# EAGLE design final 1 (EAGLE 8.1.0)
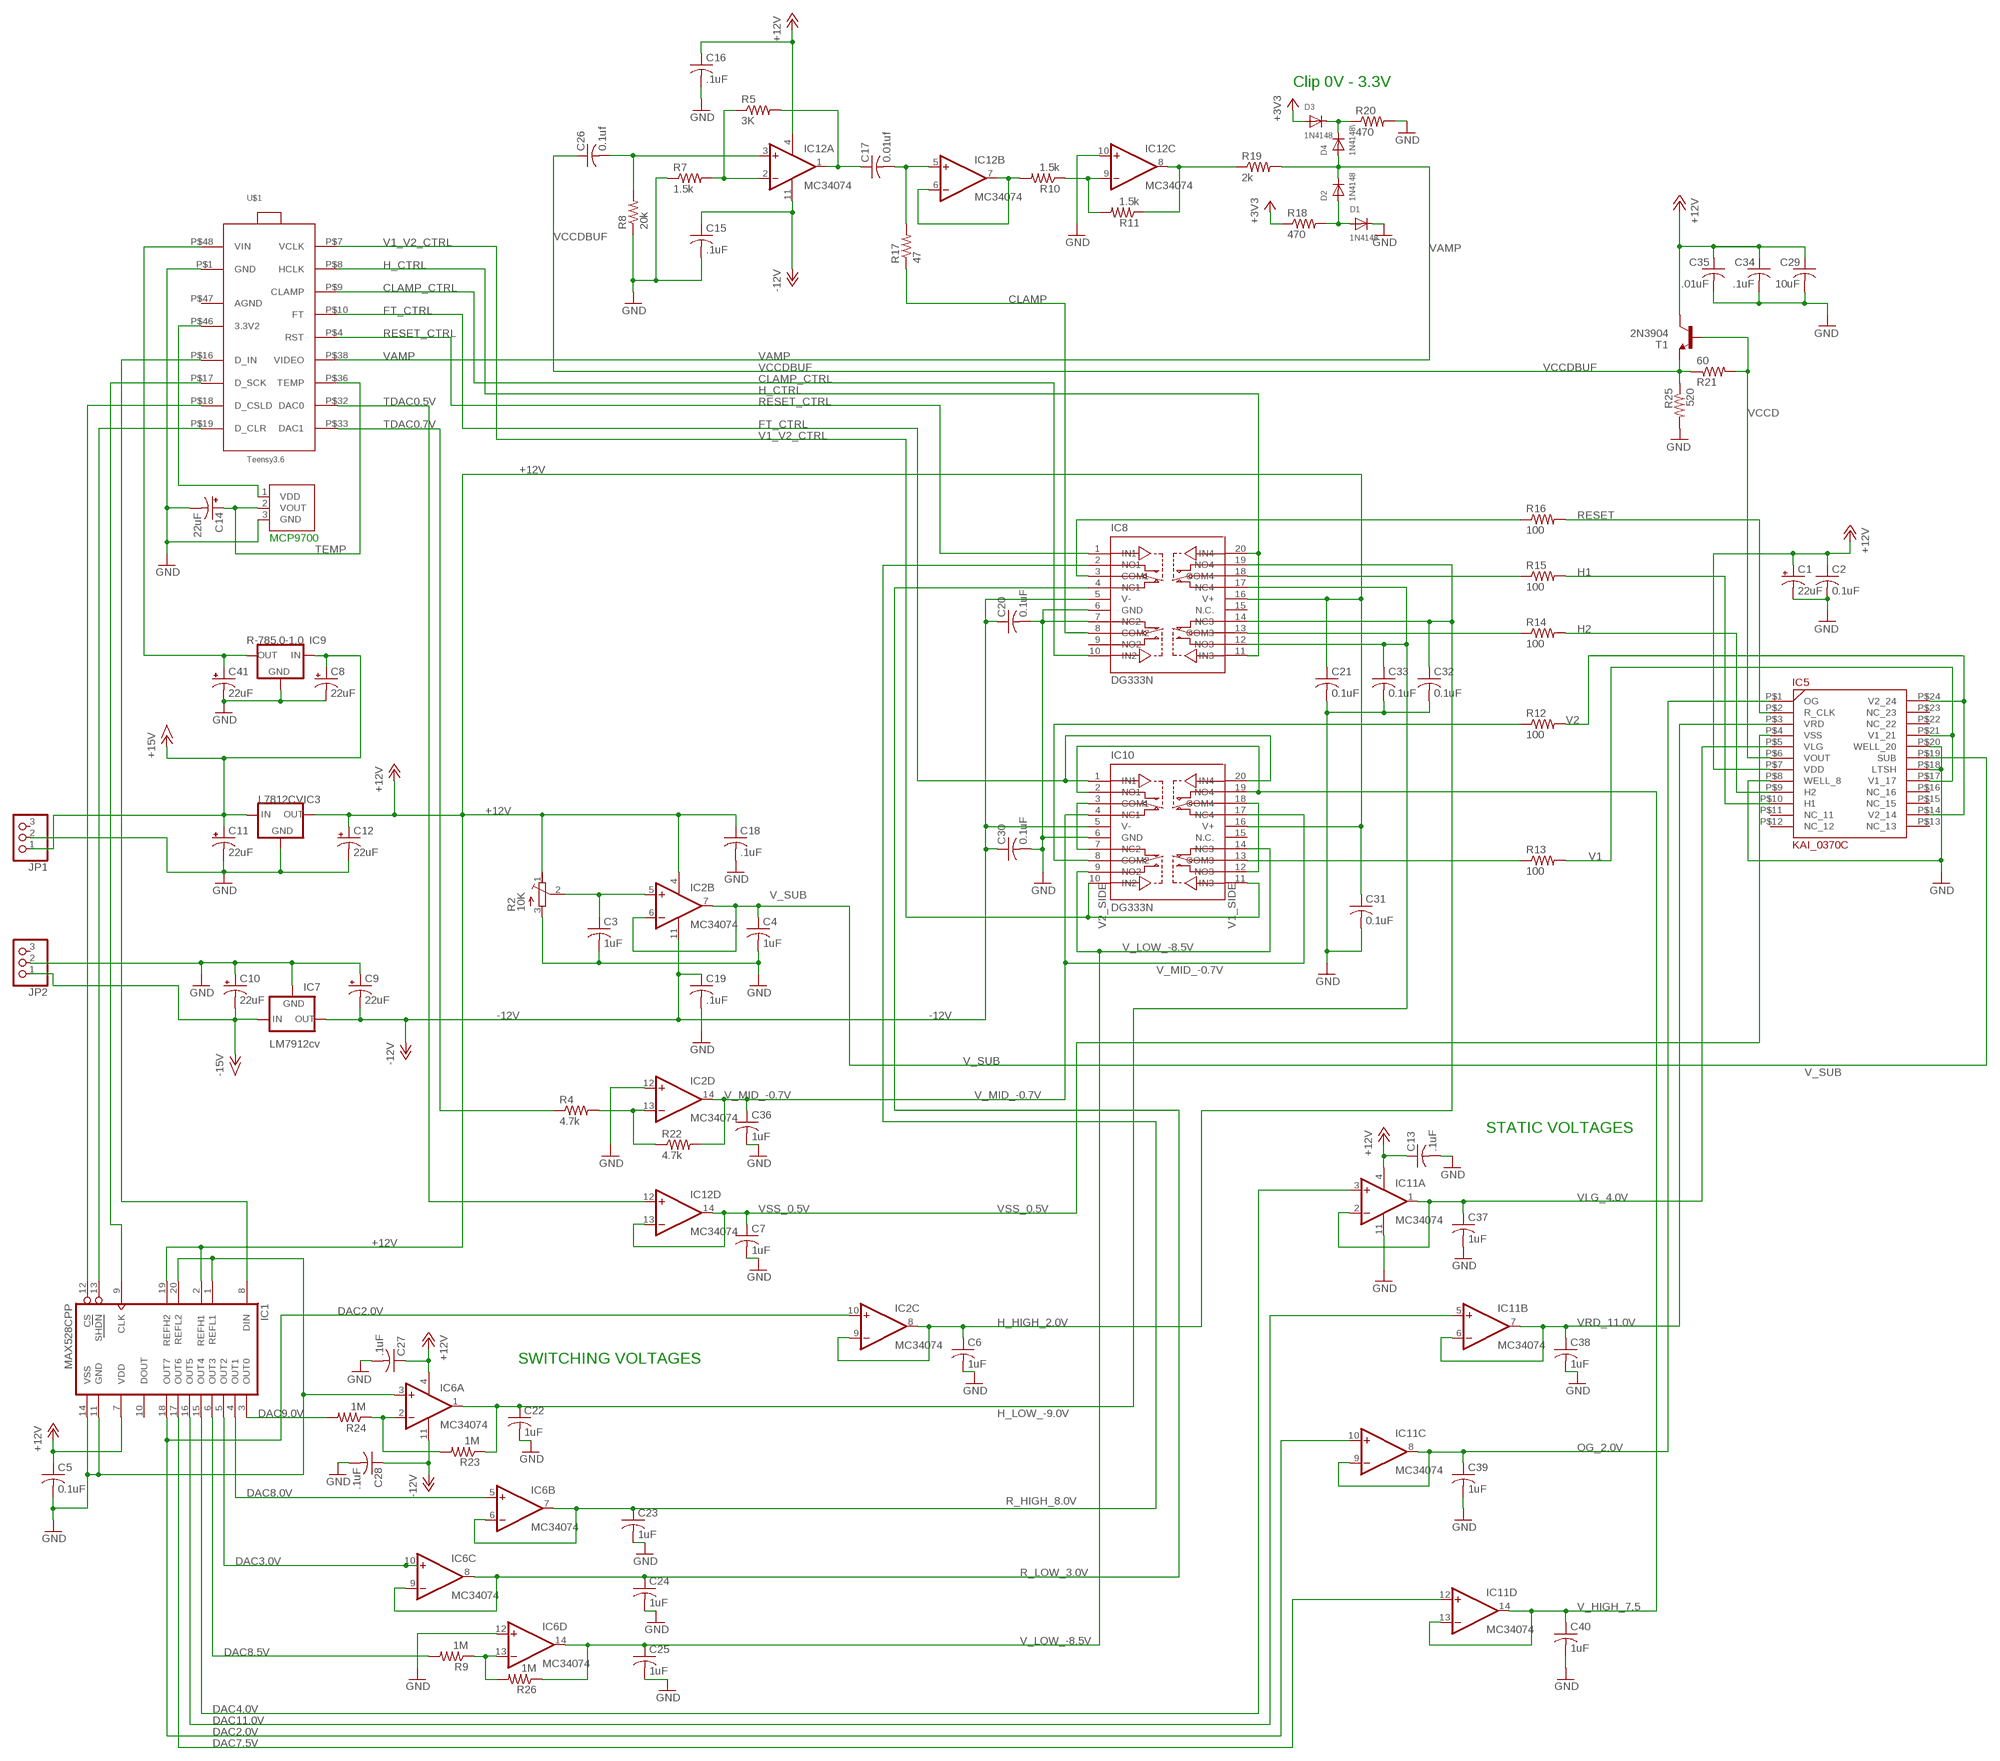
[diagram p0: schematic, sheet 1]

## Parts
C1  22uF  CPOL-USSANYO_F  [SANYO-OSCON_F]
C2  0.1uF  C-US050-050X075  [C050-050X075]
C3  1uF  C-US050-050X075  [C050-050X075]
C4  1uF  C-US050-050X075  [C050-050X075]
C5  0.1uF  C-US050-050X075  [C050-050X075]
C6  1uF  C-US050-050X075  [C050-050X075]
C7  1uF  C-US050-050X075  [C050-050X075]
C8  22uF  CPOL-USSANYO_F  [SANYO-OSCON_F]
C9  22uF  CPOL-USSANYO_F  [SANYO-OSCON_F]
C10  22uF  CPOL-USSANYO_F  [SANYO-OSCON_F]
C11  22uF  CPOL-USSANYO_F  [SANYO-OSCON_F]
C12  22uF  CPOL-USSANYO_F  [SANYO-OSCON_F]
C13  .1uF  C-US050-050X075  [C050-050X075]
C14  22uF  CPOL-USSANYO_F  [SANYO-OSCON_F]
C15  .1uF  C-US050-050X075  [C050-050X075]
C16  .1uF  C-US050-050X075  [C050-050X075]
C17  0.01uf  C-US050-050X075  [C050-050X075]
C18  .1uF  C-US050-050X075  [C050-050X075]
C19  .1uF  C-US050-050X075  [C050-050X075]
C20  0.1uF  C-US050-050X075  [C050-050X075]
C21  0.1uF  C-US050-050X075  [C050-050X075]
C22  1uF  C-US050-050X075  [C050-050X075]
C23  1uF  C-US050-050X075  [C050-050X075]
C24  1uF  C-US050-050X075  [C050-050X075]
C25  1uF  C-US050-050X075  [C050-050X075]
C26  0.1uf  C-US050-050X075  [C050-050X075]
C27  .1uF  C-US050-050X075  [C050-050X075]
C28  .1uF  C-US050-050X075  [C050-050X075]
C29  10uF  C-US050-050X075  [C050-050X075]
C30  0.1uF  C-US050-050X075  [C050-050X075]
C31  0.1uF  C-US050-050X075  [C050-050X075]
C32  0.1uF  C-US050-050X075  [C050-050X075]
C33  0.1uF  C-US050-050X075  [C050-050X075]
C34  .1uF  C-US050-050X075  [C050-050X075]
C35  .01uF  C-US050-050X075  [C050-050X075]
C36  1uF  C-US050-050X075  [C050-050X075]
C37  1uF  C-US050-050X075  [C050-050X075]
C38  1uF  C-US050-050X075  [C050-050X075]
C39  1uF  C-US050-050X075  [C050-050X075]
C40  1uF  C-US050-050X075  [C050-050X075]
C41  22uF  CPOL-USSANYO_F  [SANYO-OSCON_F]
D1  1N4148  DIODEDO-1N4148  [DO-1N4148]
D2  1N4148  DIODEDO-1N4148  [DO-1N4148]
D3  1N4148  DIODEDO-1N4148  [DO-1N4148]
D4  1N4148\  DIODEDO-1N4148  [DO-1N4148]
IC1  MAX528CPP  [DIL20]
IC2  MC34074  LM324N  [DIL14]
IC3  L7812CV  78XXS  [78XXS]
IC5  KAI_0370C  [KAI-0370C]
IC6  MC34074  LM324N  [DIL14]
IC7  LM7912cv  79XXS  [79XXS]
IC8  DG333N  MAX333N  [DIL20]
IC9  R-785.0-1.0  [SIP3]
IC10  DG333N  MAX333N  [DIL20]
IC11  MC34074  LM324N  [DIL14]
IC12  MC34074  LM324N  [DIL14]
JP1  PINHD-1X3  [1X03]
JP2  PINHD-1X3  [1X03]
R2  10K  R-TRIMM3006P  [RTRIM3006P]
R4  4.7k  R-US_0207/2V  [0207/2V]
R5  3K  R-US_0207/2V  [0207/2V]
R7  1.5k  R-US_0207/2V  [0207/2V]
R8  20k  R-US_0207/2V  [0207/2V]
R9  1M  R-US_0207/2V  [0207/2V]
R10  1.5k  R-US_0207/2V  [0207/2V]
R11  1.5k  R-US_0207/2V  [0207/2V]
R12  100  R-US_0207/2V  [0207/2V]
R13  100  R-US_0207/2V  [0207/2V]
R14  100  R-US_0207/2V  [0207/2V]
R15  100  R-US_0207/2V  [0207/2V]
R16  100  R-US_0207/2V  [0207/2V]
R17  47  R-US_0207/2V  [0207/2V]
R18  470  R-US_0207/2V  [0207/2V]
R19  2k  R-US_0207/2V  [0207/2V]
R20  470  R-US_0207/2V  [0207/2V]
R21  60  R-US_0207/2V  [0207/2V]
R22  4.7k  R-US_0207/2V  [0207/2V]
R23  1M  R-US_0207/2V  [0207/2V]
R24  1M  R-US_0207/2V  [0207/2V]
R25  520  R-US_0207/2V  [0207/2V]
R26  1M  R-US_0207/2V  [0207/2V]
T1  2N3904  [TO92]
U$1  TEENSY3.6LIMITED  [DIL]
U$2  MCP970XTO  [TO92]

## Nets
+3V3: D3.A R18.1
+5V: C41.+ IC9.3(OUT) U$1.P$48(VIN)
+12V: C1.+ C2.1 C5.1 C12.+ C13.1 C16.1 C18.1 C21.1 C27.1 C29.1 C31.1 C34.1 C35.1 IC1.2(REFH1) IC1.7(VDD) IC1.19(REFH2) IC2.4(P:V+) IC3.OUT IC5.P$7(VDD) IC6.4(P:V+) IC8.16(V+) IC10.16(V+) IC11.4(P:V+) IC12.4(P:V+) R2.1(A) T1.1(C)
+15V: C8.+ C11.+ IC3.IN IC9.1(IN) JP1.1
-12V: C9.- C15.1 C19.1 C20.1 C28.1 C30.1 IC2.11(P:V-) IC6.11(P:V-) IC7.OUT IC8.5(V-) IC10.5(V-) IC12.11(P:V-)
-15V: C10.- IC7.IN JP2.1
CLAMP: IC8.8(COM2) R17.1
CLAMP_CTRL: IC8.10(IN2) U$1.P$9(CLAMP)
DAC2.0V: IC1.18(OUT7) IC2.10(C:+IN) IC11.10(C:+IN)
DAC3.0V: IC1.5(OUT2) IC6.10(C:+IN)
DAC4.0V: IC1.15(OUT4) IC11.3(A:+IN)
DAC7.5V: IC1.17(OUT6) IC11.12(D:+IN)
DAC8.0V: IC1.4(OUT1) IC6.5(B:+IN)
DAC8.5V: IC1.6(OUT3) R9.2
DAC9.0V: IC1.3(OUT0) R24.2
DAC11.0V: IC1.16(OUT5) IC11.5(B:+IN)
FT_CTRL: IC10.1(IN1) IC10.20(IN4) U$1.P$10(FT)
GND: C1.- C2.2 C3.2 C4.2 C5.2 C6.2 C7.2 C8.- C9.+ C10.+ C11.- C12.- C13.2 C14.- C15.2 C16.2 C18.2 C19.2 C20.2 C21.2 C22.2 C23.2 C24.2 C25.2 C27.2 C28.2 C29.2 C30.2 C31.2 C32.2 C33.2 C34.2 C35.2 C36.2 C37.2 C38.2 C39.2 C40.2 C41.- D1.C IC1.1(REFL1) IC1.11(GND) IC1.14(VSS) IC1.20(REFL2) IC2.12(D:+IN) IC3.GND IC5.P$8(WELL_8) IC5.P$18(LTSH) IC5.P$20(WELL_20) IC6.3(A:+IN) IC6.12(D:+IN) IC7.GND IC8.6(GND) IC8.7(NC2) IC9.2(GND) IC10.6(GND) IC11.11(P:V-) IC12.10(C:+IN) JP1.2 JP2.2 R2.3(E) R7.1 R8.1 R20.2 R25.2 U$1.P$1(GND) U$2.3(GND)
H1: IC5.P$10(H1) R15.2
H2: IC5.P$9(H2) R14.2
H_CTRL: IC8.11(IN3) IC8.20(IN4) U$1.P$8(HCLK)
H_HIGH_2.0V: C6.1 C32.1 IC2.8(C:OUT) IC2.9(C:-IN) IC8.14(NC3) IC8.19(NO4)
H_LOW_-9.0V: C22.1 C33.1 IC6.1(A:OUT) IC8.12(NO3) IC8.17(NC4) R23.1
N$3: U$1.P$46(3.3V2) U$2.1(VDD)
N$4: IC10.3(COM1) IC10.7(NC2)
N$5: IC10.8(COM2) R12.1
N$6: IC1.8(DIN) U$1.P$16(D_IN)
N$7: C3.1 IC2.5(B:+IN) R2.2(S)
N$8: C17.1 IC12.1(A:OUT) R5.2
N$9: IC10.12(NO3) IC10.18(COM4)
N$10: IC1.9(CLK) U$1.P$17(D_SCK)
N$11: IC2.13(D:-IN) R4.2 R22.1
N$14: IC12.2(A:-IN) R5.1 R7.2
N$15: IC1.12(CS) U$1.P$18(D_CSLD)
N$16: IC1.13(SHDN) U$1.P$19(D_CLR)
N$18: IC12.8(C:OUT) R11.1 R19.1
N$19: IC8.13(COM3) R14.1
N$20: IC6.2(A:-IN) R23.2 R24.1
N$22: IC8.18(COM4) R15.1
N$25: IC12.6(B:-IN) IC12.7(B:OUT) R10.2
N$28: IC5.P$2(R_CLK) R16.2
N$29: IC12.9(C:-IN) R10.1 R11.2
N$31: C26.2 IC12.3(A:+IN) R8.2
N$33: D1.A D2.A R18.2
N$34: D3.C D4.C R20.1
N$35: C17.2 IC12.5(B:+IN) R17.2
N$36: IC6.13(D:-IN) R9.1 R26.2
OG_2.0V: C39.1 IC5.P$1(OG) IC11.8(C:OUT) IC11.9(C:-IN)
R_HIGH_8.0V: C23.1 IC6.6(B:-IN) IC6.7(B:OUT) IC8.2(NO1)
R_LOW_3.0V: C24.1 IC6.8(C:OUT) IC6.9(C:-IN) IC8.4(NC1)
RESET: IC8.3(COM1) R16.1
RESET_CTRL: IC8.1(IN1) U$1.P$4(RST)
TDAC0.5V: IC12.12(D:+IN) U$1.P$32(DAC0)
TDAC0.7V: R4.1 U$1.P$33(DAC1)
TEMP: C14.+ U$1.P$36(TEMP) U$2.2(VOUT)
V1: IC5.P$17(V1_17) IC5.P$21(V1_21) R13.2
V1_V2_CTRL: IC10.10(IN2) IC10.11(IN3) U$1.P$7(VCLK)
V2: IC5.P$14(V2_14) IC5.P$24(V2_24) R12.2
V_2: IC10.13(COM3) R13.1
V_HIGH_7.5: C40.1 IC10.2(NO1) IC10.19(NO4) IC11.13(D:-IN) IC11.14(D:OUT)
V_LOW_-8.5V: C25.1 IC6.14(D:OUT) IC10.9(NO2) IC10.14(NC3) R26.1
V_MID_-0.7V: C36.1 IC2.14(D:OUT) IC10.4(NC1) IC10.17(NC4) R22.2
V_SUB: C4.1 IC2.6(B:-IN) IC2.7(B:OUT) IC5.P$19(SUB)
VAMP: D2.C D4.A R19.2 U$1.P$38(VIDEO)
VCCD: IC5.P$6(VOUT) R21.2 T1.2(B)
VCCDBUF: C26.1 R21.1 R25.1 T1.3(E)
VLG_4.0V: C37.1 IC5.P$5(VLG) IC11.1(A:OUT) IC11.2(A:-IN)
VRD_11.0V: C38.1 IC5.P$3(VRD) IC11.6(B:-IN) IC11.7(B:OUT)
VSS_0.5V: C7.1 IC5.P$4(VSS) IC12.13(D:-IN) IC12.14(D:OUT)
Unconnected: IC1.10(DOUT) IC2.1(A:OUT) IC2.2(A:-IN) IC2.3(A:+IN) IC5.P$11(NC_11) IC5.P$12(NC_12) IC5.P$13(NC_13) IC5.P$15(NC_15) IC5.P$16(NC_16) IC5.P$22(NC_22) IC5.P$23(NC_23) IC8.9(NO2) IC8.15(N.C.) IC10.15(N.C.) JP1.3 JP2.3

## Notes on the sheet
- Clip 0V - 3.3V
- MCP9700
- V2_SIDE | V1_SIDE
- STATIC VOLTAGES
- SWITCHING VOLTAGES

## Power pins joined to a net without a drawn wire
AGND: U$1.P$47(AGND)

## Library data of the parts
C1 C8-C12 C14 C41 = rcl:CPOL-US: POLARIZED CAPACITOR, American symbol
C2-C7 C13 C15-C40 = rcl:C-US: CAPACITOR, American symbol
D1-D4 = adafruit:DIODE: Diode SMADIODE - SMA Surface Mount Package 20V 1A Schottky Diode Digikey: 641-1014-6-ND DO-1N4148 - Through Hole Small Current Diode SOD-123 20V 1 A (.5mV Vf) Schottky Diode - Digikey: MBRX120TPMSCT-ND SOD-323 10V 570mA (.38mV Vf, 3ns) Schottky Diode - Digikey: ZLLS410CT-ND SOD-523 30V 30mA Schottky Diode (RB751S-40TE61) - Digikey: RB751S-40TE61CT-ND SOT23-R/W - SOT23 Package (R = Solder Paste/Reflow Ovens, W = Hand-Soldering) BAT54Film 40V 300mA - Digikey: 497-7162-1-ND
IC1 = maxim:MAX528CPP: DIGITAL/ANALOG CONVERTER
IC2 IC6 IC11 IC12 = linear:LM324: OP AMP
IC3 = v-reg:78XXS: VOLTAGE REGULATOR
IC5 = dudek_Lenovo_20170214:KAI_0370C
IC7 = v-reg:79XXS: VOLTAGE REGULATOR
IC8 IC10 = dudek:MAX333
IC9 = r-78xx_10:R-78*-1.0: Innoline R-78xx-1.0 Series Switching Regulators - 1.0A, Standard Source: http://www.recom-international.com/pdf/Innoline/R-78xx-1.0.pdf; MF: Recom; MPN: R-785.0-1.0; OC_FARNELL: 1793143; OC_NEWARK: 62X9542
JP1 JP2 = pinhead:PINHD-1X3: PIN HEADER
R2 = resistor:R-TRIMM: Trimm resistor
R4 R5 R7-R26 = rcl:R-US_: RESISTOR, American symbol
T1 = transistor:2N3904: NPN TRANSISTOR
U$1 = teensy:TEENSY3.6LIMITED
U$2 = mcp970x:MCP970X

## Board
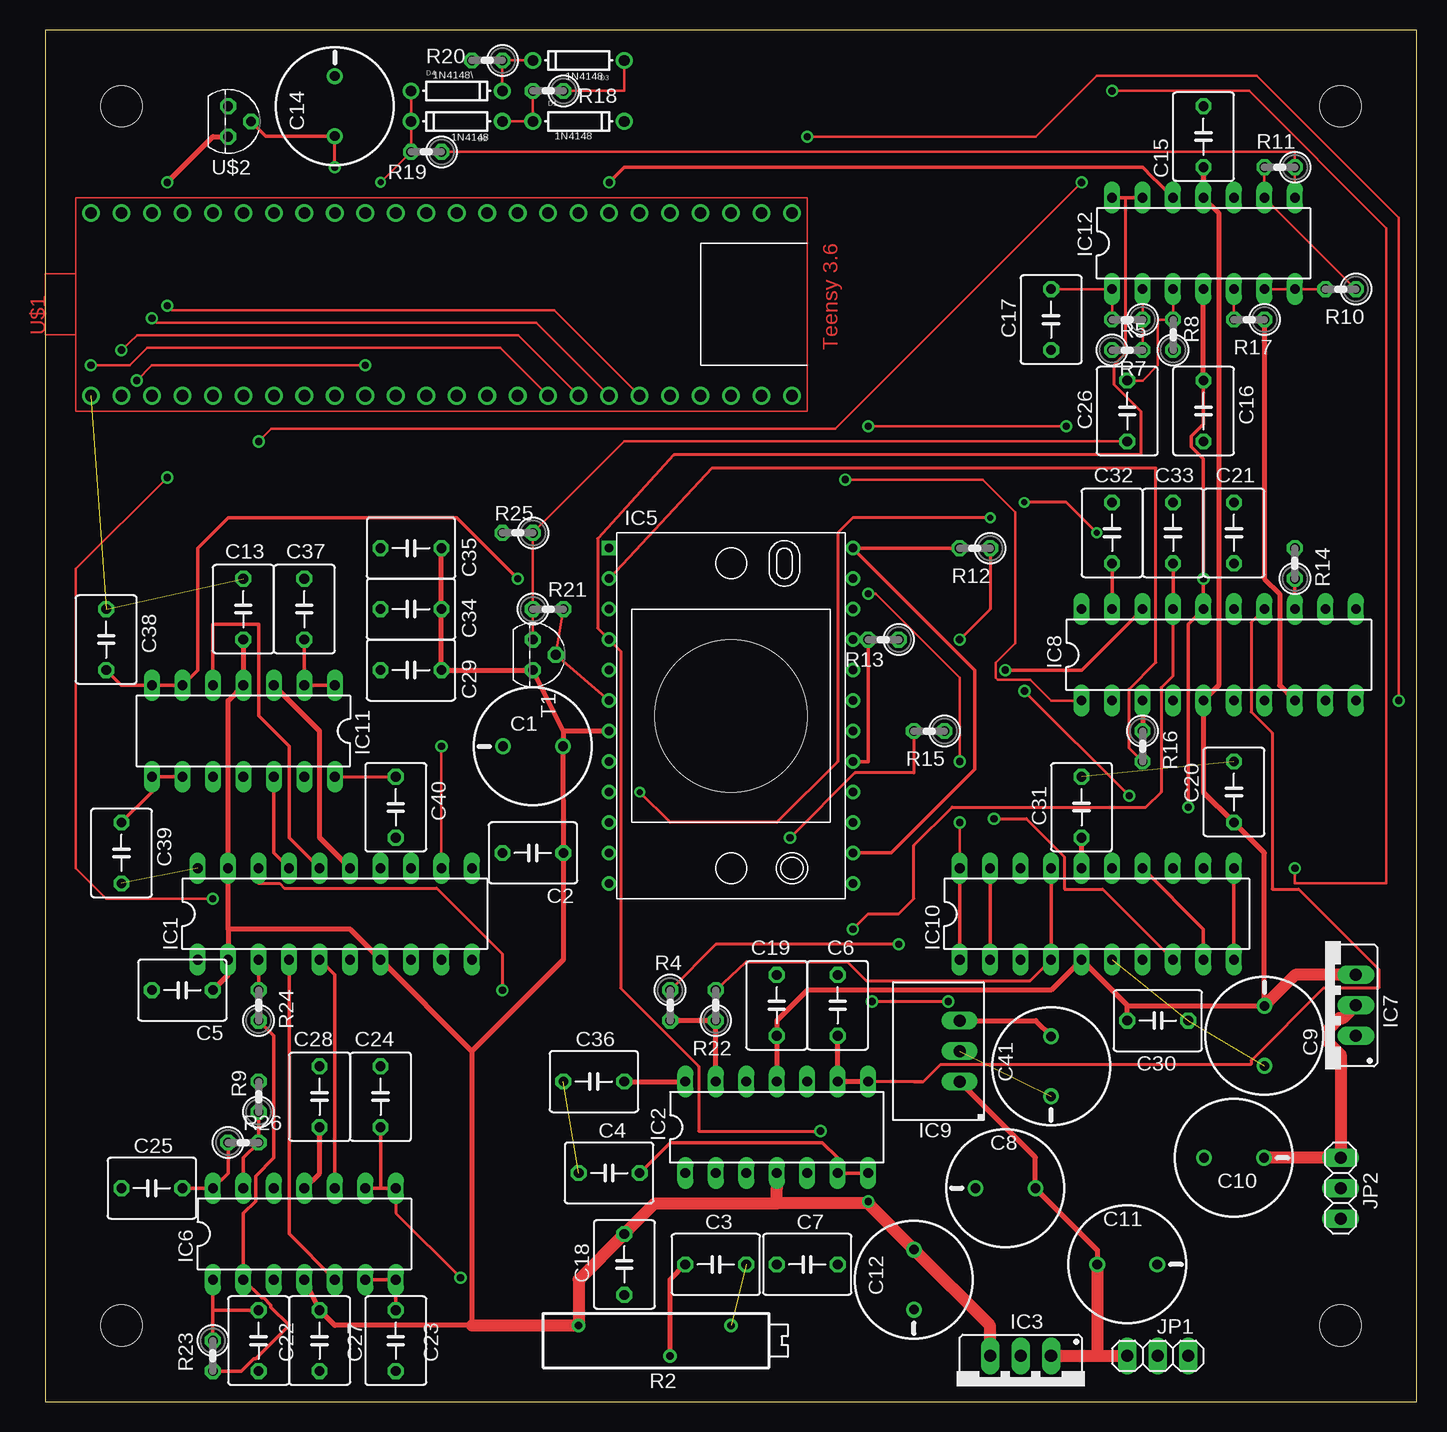
[diagram p1: board, top side]
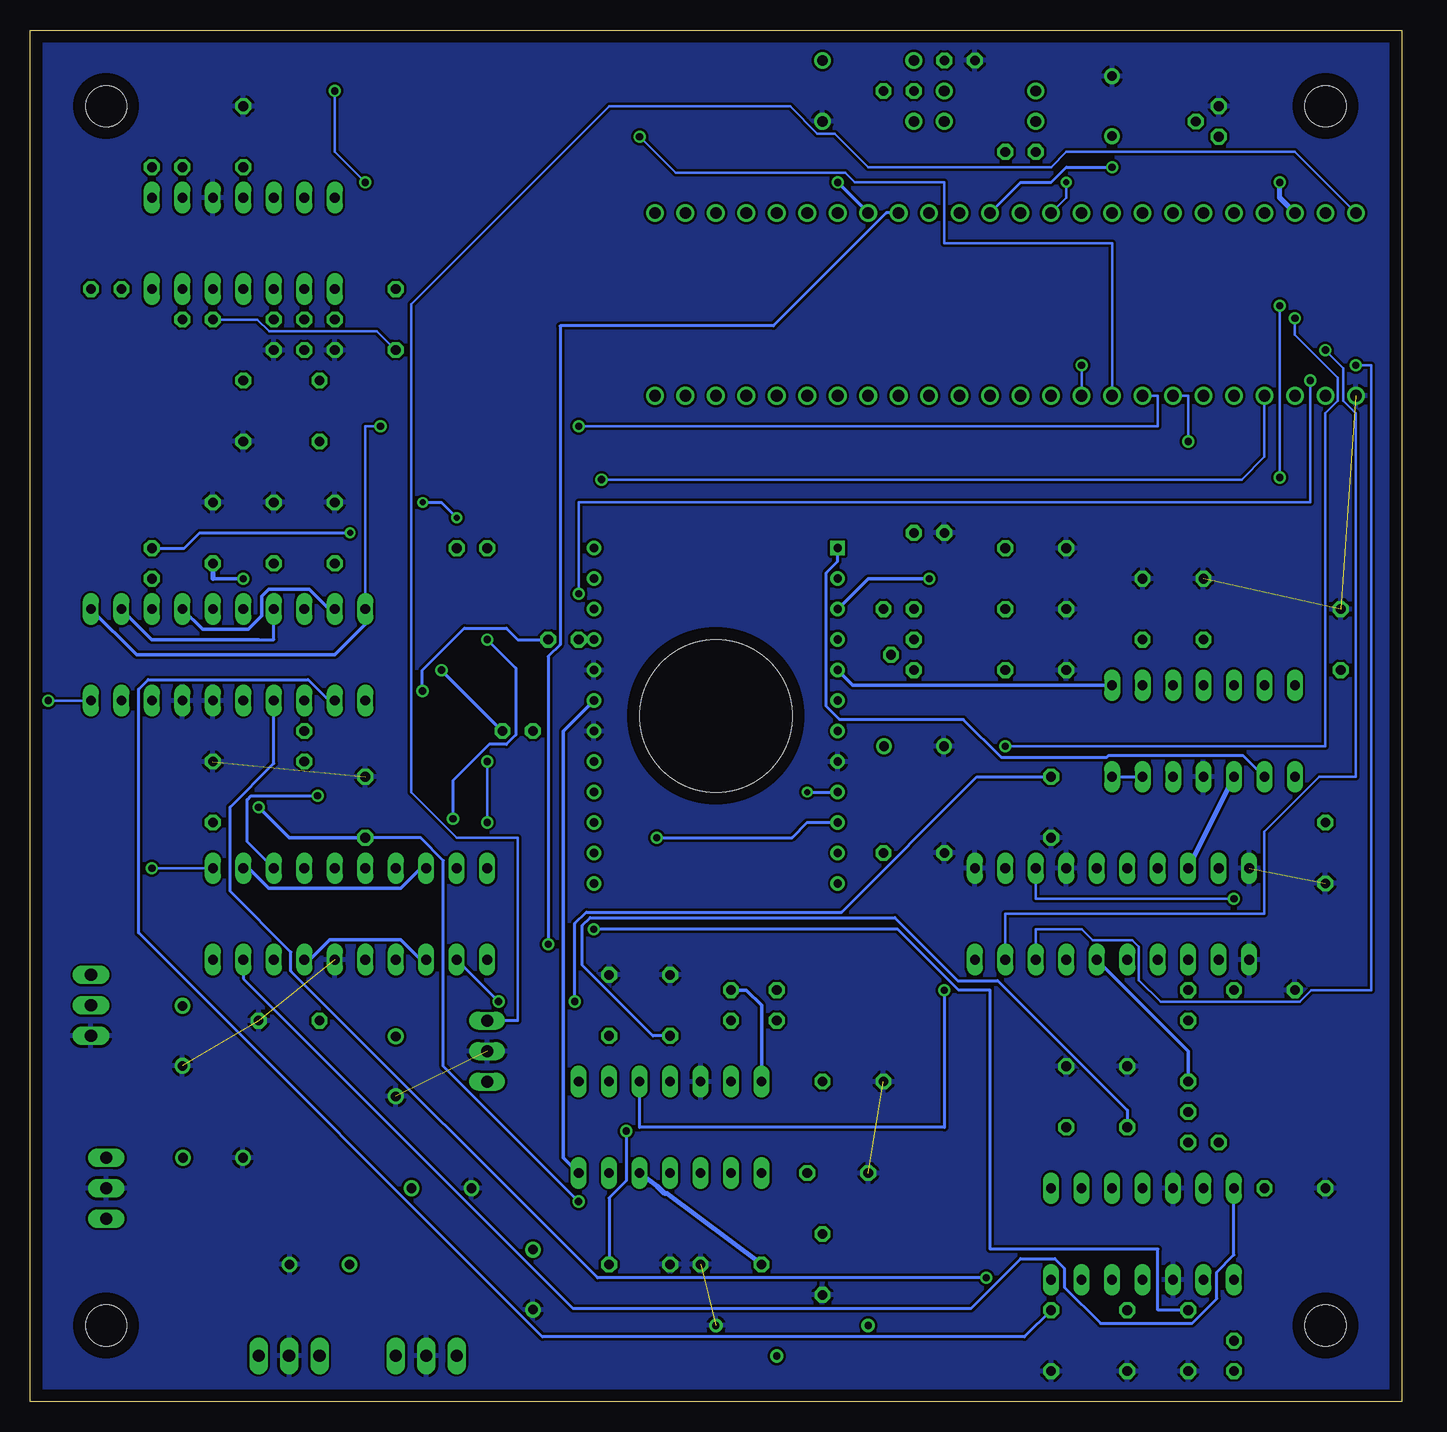
[diagram p2: board, bottom side, seen from below]

Size 114.3 x 114.3 mm. Coordinates in mm from the lower left corner, seen from the top.
Outline: 0,0 114.3,0 114.3,114.3 0,114.3 0,0
Copper layers (1*16): Top 0.035mm / dielectric 1.5mm / Bottom 0.035mm
Design rules "default *": minimum track width 8mil, minimum drill 19mil, track to track 8mil, track to pad 8mil, pad to pad 8mil, via to via 8mil, smd to smd 8mil, copper to edge 40mil, drill to drill 8mil, minimum pad ring 10mil, minimum via ring 8mil, stop-mask expansion 4mil, vias tented up to drill 0mil, thermal gap 10mil
Holes 3.43 mm at 107.95,6.35 107.95,107.95 6.35,107.95 6.35,6.35
Holes 12.7 mm at 57.15,57.15

### Footprints (pad centres in the part's own frame; a part is rotated, then mirrored left to right if it is on the bottom)
SANYO-OSCON_F = drill 0.8 pad 1.27: + 2.5,0; - -2.5,0
C050-050X075 = drill 0.813 octagon: 1 -2.54,0; 2 2.54,0
DO-1N4148 = drill 0.9: A -3.81,0; C 3.81,0
DIL20 = drill 0.813 long: 1 -11.43,-3.81; 2 -8.89,-3.81; 3 -6.35,-3.81; 4 -3.81,-3.81; 5 -1.27,-3.81; 6 1.27,-3.81; 7 3.81,-3.81; 8 6.35,-3.81; 9 8.89,-3.81; 10 11.43,-3.81; 11 11.43,3.81; 12 8.89,3.81; 13 6.35,3.81; 14 3.81,3.81; 15 1.27,3.81; 16 -1.27,3.81; 17 -3.81,3.81; 18 -6.35,3.81; 19 -8.89,3.81; 20 -11.43,3.81
DIL14 = drill 0.813 long: 1 -7.62,-3.81; 2 -5.08,-3.81; 3 -2.54,-3.81; 4 0,-3.81; 5 2.54,-3.81; 6 5.08,-3.81; 7 7.62,-3.81; 8 7.62,3.81; 9 5.08,3.81; 10 2.54,3.81; 11 0,3.81; 12 -2.54,3.81; 13 -5.08,3.81; 14 -7.62,3.81
78XXS = drill 1.016 long: GND 0,-2.54; IN -2.54,-2.54; OUT 2.54,-2.54
KAI-0370C = drill 0.7 square: P$1 -10.16,13.97 | drill 0.7: P$2 -10.16,11.43; P$3 -10.16,8.89; P$4 -10.16,6.35; P$5 -10.16,3.81; P$6 -10.16,1.27; P$7 -10.16,-1.27; P$8 -10.16,-3.81; P$9 -10.16,-6.35; P$10 -10.16,-8.89; P$11 -10.16,-11.43; P$12 -10.16,-13.97; P$13 10.16,-13.97; P$14 10.16,-11.43; P$15 10.16,-8.89; P$16 10.16,-6.35; P$17 10.16,-3.81; P$18 10.16,-1.27; P$19 10.16,1.27; P$20 10.16,3.81; P$21 10.16,6.35; P$22 10.16,8.89; P$23 10.16,11.43; P$24 10.16,13.97
79XXS = drill 1.016 long: GND -2.54,-2.54; IN 0,-2.54; OUT 2.54,-2.54
SIP3 = drill 1 long: 1 -2.54,0; 2 0,0; 3 2.54,0
1X03 = drill 1.016 long: 1 -2.54,0; 2 0,0; 3 2.54,0
RTRIM3006P = drill 0.61: 1 -7.62,1.27; 2 0,-1.27; 3 5.08,1.27
0207/2V = drill 0.813 octagon: 1 -1.27,0; 2 1.27,0
TO92 = drill 0.813 octagon: 1 1.27,0; 2 0,1.905; 3 -1.27,0
DIL = drill 0.965: P$1 -3.81,15.24; P$2 -3.81,12.7; P$3 -3.81,10.16; P$4 -3.81,7.62; P$5 -3.81,5.08; P$6 -3.81,2.54; P$7 -3.81,0; P$8 -3.81,-2.54; P$9 -3.81,-5.08; P$10 -3.81,-7.62; P$11 -3.81,-10.16; P$12 -3.81,-12.7; P$13 -3.81,-15.24; P$14 -3.81,-17.78; P$15 -3.81,-20.32; P$16 -3.81,-22.86; P$17 -3.81,-25.4; P$18 -3.81,-27.94; P$19 -3.81,-30.48; P$20 -3.81,-33.02; P$21 -3.81,-35.56; P$22 -3.81,-38.1; P$23 -3.81,-40.64; P$24 -3.81,-43.18; P$25 11.43,-43.18; P$26 11.43,-40.64; P$27 11.43,-38.1; P$28 11.43,-35.56; P$29 11.43,-33.02; P$30 11.43,-30.48; P$31 11.43,-27.94; P$32 11.43,-25.4; P$33 11.43,-22.86; P$34 11.43,-20.32; P$35 11.43,-17.78; P$36 11.43,-15.24; P$37 11.43,-12.7; P$38 11.43,-10.16; P$39 11.43,-7.62; P$40 11.43,-5.08; P$41 11.43,-2.54; P$42 11.43,0; P$43 11.43,2.54; P$44 11.43,5.08; P$45 11.43,7.62; P$46 11.43,10.16; P$47 11.43,12.7; P$48 11.43,15.24

### Placement (x,y rotation side)
C1  40.64,54.61 0 top
C2  40.64,45.72 180 top
C3  55.88,11.43 0 top
C4  46.99,19.05 180 top
C5  11.43,34.29 180 top
C6  66.04,33.02 90 top
C7  63.5,11.43 180 top
C8  80.01,17.78 0 top
C9  101.6,30.48 270 top
C10  99.06,20.32 180 top
C11  90.17,11.43 180 top
C12  72.39,10.16 90 top
C13  16.51,66.04 90 top
C14  24.13,107.95 270 top
C15  96.52,105.41 90 top
C16  96.52,82.55 270 top
C17  83.82,90.17 270 top
C18  48.26,11.43 270 top
C19  60.96,33.02 90 top
C20  99.06,50.8 90 top
C21  99.06,72.39 90 top
C22  17.78,5.08 270 top
C23  29.21,5.08 270 top
C24  27.94,25.4 90 top
C25  8.89,17.78 180 top
C26  90.17,82.55 90 top
C27  22.86,5.08 270 top
C28  22.86,25.4 90 top
C29  30.48,60.96 180 top
C30  92.71,31.75 0 top
C31  86.36,49.53 90 top
C32  88.9,72.39 90 top
C33  93.98,72.39 90 top
C34  30.48,66.04 180 top
C35  30.48,71.12 180 top
C36  45.72,26.67 180 top
C37  21.59,66.04 90 top
C38  5.08,63.5 90 top
C39  6.35,45.72 270 top
C40  29.21,49.53 270 top
C41  83.82,27.94 90 top
D1  44.45,106.68 0 top
D2  34.29,106.68 180 top
D3  44.45,111.76 180 top
D4  34.29,109.22 0 top
IC1  24.13,40.64 0 top
IC2  60.96,22.86 0 top
IC3  81.28,1.27 180 top
IC5  57.15,57.15 0 top
IC6  21.59,13.97 0 top
IC7  106.68,33.02 90 top
IC8  97.79,62.23 0 top
IC9  76.2,29.21 90 top
IC10  87.63,40.64 0 top
IC11  16.51,55.88 180 top
IC12  96.52,96.52 0 top
JP1  92.71,3.81 0 top
JP2  107.95,17.78 270 top
R2  52.07,5.08 0 top
R4  52.07,33.02 270 top
R5  90.17,90.17 180 top
R7  90.17,87.63 0 top
R8  93.98,88.9 90 top
R9  17.78,25.4 90 top
R10  107.95,92.71 180 top
R11  102.87,102.87 180 top
R12  77.47,71.12 180 top
R13  69.85,63.5 180 top
R14  104.14,69.85 90 top
R15  73.66,55.88 180 top
R16  91.44,54.61 270 top
R17  100.33,90.17 180 top
R18  41.91,109.22 180 top
R19  31.75,104.14 180 top
R20  36.83,111.76 180 top
R21  41.91,66.04 0 top
R22  55.88,33.02 90 top
R23  13.97,3.81 270 top
R24  17.78,33.02 90 top
R25  39.37,72.39 180 top
R26  16.51,21.59 0 top
T1  40.64,62.23 270 top
U$1  19.05,87.63 90 top
U$2  15.24,106.68 270 top

### Tracks (layer width: path | path; a pad name or v marks a point on that pad's centre or on a via)
+3V3
  Top 0.203: R18.1 48.26,109.22 D3.A
+5V
  Top 0.406: IC9.3 82.55,31.75 83.82,30.48 C41.+
  Bottom 0.203: U$1.P$48 8.89,104.14 27.94,104.14 29.21,102.87 44.45,102.87 47.25,105.67 48.68,105.67 50.96,107.95 66.04,107.95 82.55,91.44 82.55,50.8 78.74,46.99 73.66,46.99 73.66,31.75
  Bottom 0.254: 73.66,31.75 IC9.3
+12V  (via drill 0.6, 0.61)
  Top 0.254: v68.58,16.67 68.58,16.51
  Top 0.305: v95.25,49.53 95.25,64.77 IC8.16 v96.52,68.58 96.52,78.57 95.5,79.59 95.5,80.43 96.52,81.45 C16.1
  Top 0.406: C12.+ 72.39,12.7 | 60.96,17.78 IC2.4 | 15.24,39.37 IC1.2 15.24,35.56 C5.1 | 15.24,39.37 IC1.19 15.24,58.42 IC11.4 C13.1 | IC10.16 C31.1 | IC6.4 C27.1 24.13,6.35 35.56,6.35 35.56,29.21 | C35.1 C34.1 C29.1 T1.1 43.18,55.88 | 43.18,55.88 C1.+ C2.1 43.18,36.83 35.56,29.21 | IC5.P$7 43.18,55.88 | C16.1 IC12.4 | 15.24,39.37 25.4,39.37 IC1.7 35.56,29.21
  Top 1.016: IC3.OUT 78.74,6.31 C12.+ | 72.39,12.7 68.58,16.51 60.96,16.51 | 60.96,16.51 50.8,16.51 C18.1 44.45,10.16 R2.1 35.56,6.35 | 60.96,16.51 60.96,17.78
  Bottom 0.254: C31.1 81.76,46.99 79.85,45.09 79.85,27.94 v68.58,16.67
  Bottom 0.305: v95.25,49.53 92.71,46.99 C31.1 | 99.06,68.58 v96.52,68.58
  Bottom 0.406: C21.1 99.06,68.58
+15V
  Top 0.406: C11.+ 87.67,12.62 C8.+ 82.51,20.36 IC9.1
  Top 1.016: IC3.IN 87.63,3.81 | 87.63,3.81 JP1.1 | C11.+ 87.67,3.85 87.63,3.81
-12V
  Top 0.406: C15.1 IC12.11 97.79,99.06 97.79,59.69 IC8.5 96.52,50.8 C20.1 101.6,45.72 C9.- 90.21,32.98 | IC2.11 C19.1 60.96,31.75 63.5,34.29 83.82,34.29 IC10.5 90.21,32.98 | C30.1 90.17,32.94 90.21,32.98 | IC6.11 22.86,19.05 C28.1
  Top 1.016: IC7.OUT 104.18,35.56 C9.-
  Bottom 0.254: C28.1 22.86,24.29 33.66,35.08 36.99,35.08 42.23,40.32 67.63,40.32 68.26,39.69 68.26,36.35 62.39,30.48 C19.1
-15V
  Top 1.016: IC7.IN 108.15,31.95 107.85,31.95 106.98,31.09 106.98,29.87 107.95,28.91 JP2.1 C10.-
CLAMP
  Top 0.406: R17.1 101.6,68.58 102.87,67.31 102.87,59.69 IC8.8
CLAMP_CTRL  (via drill 0.6)
  Top 0.203: v63.5,105.41 82.55,105.41 87.63,110.49 100.97,110.49 112.78,98.67 v112.78,58.42
  Bottom 0.203: U$1.P$9 24.13,96.52 38.1,96.52 38.1,101.6 45.55,101.6 46.36,102.41 60.5,102.41 v63.5,105.41 | v112.78,58.42 IC8.10
DAC2.0V  (via drill 0.6)
  Top 0.254: IC1.18 17.78,43.18 19.53,43.18 19.91,42.8 32.61,42.8 38.1,37.31 v38.1,34.29
  Bottom 0.254: v38.1,34.29 38.1,22.86 63.5,22.86 IC2.10
  Bottom 0.406: IC11.10 IC1.18
DAC3.0V
  Top 0.305: IC1.5 24.13,35.56 IC6.10
DAC4.0V
  Top 0.406: IC1.15 22.86,46.99 22.86,55.88 IC11.3
DAC7.5V
  Top 0.305: IC11.12 19.05,45.72 IC1.17
DAC8.0V
  Top 0.305: IC1.4 20.32,13.97 IC6.5
DAC8.5V
  Bottom 0.305: IC1.6 17.78,29.21 R9.2
DAC9.0V
  Top 0.305: R24.2 IC1.3
DAC11.0V
  Top 0.305: IC1.16 20.32,46.99 20.32,54.61 17.78,57.15 17.78,64.77 13.97,64.77 IC11.5
FT_CTRL  (via drill 0.6)
  Top 0.203: v26.67,86.36 8.89,86.36 v7.62,85.09 | v76.2,53.34 76.2,60.31 69.2,67.31 v68.58,67.31 | v76.2,48.26 IC10.20
  Top 0.305: IC10.20 IC10.1
  Bottom 0.203: U$1.P$10 v26.67,86.36 | v7.62,85.09 7.62,74.93 68.58,74.93 v68.58,67.31 | v76.2,53.34 v76.2,48.26
GND  (9 unrouted)
  Bottom 0.254: C38.2
  pour Bottom: 0,114.3 114.3,114.3 114.3,0 0,0
H1  (via drill 0.61)
  Top 0.254: v62.07,46.99 67.47,52.39 72.39,52.39 R15.2
  Bottom 0.254: v62.07,46.99 50.8,46.99 49.53,48.26 IC5.P$10
H2  (via drill 0.5)
  Top 0.254: v87.63,72.39 85.09,74.93 v81.58,74.93 | v78.74,73.66 67.31,73.66 66.04,72.39 66.04,53.34 60.96,48.26 52.07,48.26 v49.53,50.8
  Bottom 0.254: R14.2 101.44,71.12 100.17,72.39 v87.63,72.39 | v81.58,74.93 80.01,74.93 v78.74,73.66 | v49.53,50.8 IC5.P$9
H_CTRL  (via drill 0.6)
  Top 0.203: v68.58,81.28 v85.09,81.28
  Bottom 0.203: U$1.P$8 20.32,83.82 20.32,81.28 v68.58,81.28 | v85.09,81.28 86.36,81.28 IC8.20
  Bottom 0.305: IC8.11 105.41,62.23 88.9,62.23 86.36,64.77 IC8.20
H_HIGH_2.0V
  Top 0.254: 73.03,26.67 72.39,26.67 | 72.39,26.67 IC2.8 | IC8.14 100.49,64.93 100.49,57.47 102.23,55.72 102.23,42.7 104.46,42.7 111.12,36.04 111.12,34.45 106.52,34.45 100.49,28.42 100.49,28.1 74.61,28.1 73.18,26.67 72.39,26.67
  Top 0.305: C32.1 IC8.19
  Top 0.406: C6.1 IC2.9 IC2.8
  Bottom 0.305: IC8.14 99.92,64.36 96.1,64.36 95,65.47 95,67.12 94.4,67.72 91.02,67.72 89.34,66.04 IC8.19
H_LOW_-9.0V  (via drill 0.6)
  Top 0.254: IC8.17 93.98,60.48 92.99,59.49 92.99,50.8 91.72,49.53 75.56,49.53 72.39,46.35 72.39,41.91 71.12,40.64 68.58,40.64 v67.31,39.37
  Top 0.305: 13.97,7.62 R23.1 | 13.97,7.62 IC6.1 | C22.1 13.97,7.62 | IC8.17 C33.1
  Bottom 0.254: C22.1 20.32,7.62 20.32,12.7 34.29,12.7 34.29,34.29 36.92,34.29 42,39.37 v67.31,39.37 | 95.25,63.5 93.98,63.5 IC8.17
  Bottom 0.305: IC8.12 104.14,63.5 95.25,63.5 | IC8.17 93.98,64.77
N$3  (via drill 0.6)
  Top 0.406: v10.16,101.6 13.97,105.41 U$2.1
  Bottom 0.406: U$1.P$46 10.16,100.33 v10.16,101.6
N$4
  Bottom 0.305: IC10.7 91,36.83 89.32,38.51 83.4,38.51 81.72,36.83 IC10.3
N$5  (via drill 0.61)
  Top 0.254: IC10.8 88.11,42.7 84.93,42.7 84.93,45.4 81.76,48.58 v79.06,48.58 | v76.2,63.5 78.74,66.04 R12.1
  Bottom 0.254: v79.06,48.58 79.06,51.75 76.04,54.77 74.61,54.77 73.82,55.56 73.82,61.12 v76.2,63.5
N$6  (via drill 0.6)
  Top 0.203: v3.81,86.36 7.04,86.36 8.49,87.8 37.93,87.8 U$1.P$16
  Bottom 0.203: v3.81,86.36 2.54,86.36 2.54,34.29 7.53,34.29 8.49,33.33 20.09,33.33 21.89,35.13 21.89,37.89 22.46,38.46 25.76,38.46 26.67,39.37 30.48,39.37 IC1.8
N$7
  Top 0.406: R2.2 52.07,10.16 C3.1
  Bottom 0.406: C3.1 61.2,17.32 61.4,17.32 62.02,17.94 IC2.5
N$8
  Top 0.203: C17.1 IC12.1 R5.2
N$9
  Bottom 0.305: IC10.18 81.72,44.45 83.4,42.77 94.4,42.77 96.08,44.45 IC10.12
N$10  (via drill 0.6)
  Top 0.203: v6.35,87.63 7.68,88.84 39.43,88.84 U$1.P$17
  Bottom 0.203: v6.35,87.63 4.85,86.13 4.85,83.39 3.81,82.35 3.81,52.07 6.87,52.07 11.43,47.51 11.43,40.64 33.02,40.64 IC1.9
N$11
  Top 0.406: IC2.13 R22.1 R4.2
N$14
  Top 0.203: IC12.2 R5.1 R7.2
N$15  (via drill 0.6)
  Top 0.203: v8.89,90.29 9.29,89.89 40.92,89.89 U$1.P$18 | v33.02,54.61 IC1.12
  Bottom 0.203: v8.89,90.29 8.89,88.9 5.31,85.32 5.31,83.39 6.35,82.35 6.35,54.61 v33.02,54.61
N$16  (via drill 0.6)
  Top 0.203: v10.16,91.33 10.56,90.93 42.42,90.93 U$1.P$19 | v10.16,77.01 2.54,69.39 2.54,44.45 5.08,41.91 v13.97,41.91
  Bottom 0.203: v10.16,91.33 v10.16,77.01 | v13.97,41.91 30.48,41.91 IC1.13
N$18
  Top 0.203: IC12.8 R11.1 104.14,104.14 R19.1
N$19
  Top 0.305: R14.1 IC8.13
N$20
  Top 0.305: R23.2 16.34,2.54 17.36,3.56 17.53,3.56 20.32,6.35 18.8,7.87 18.8,8.04 18.2,8.64 18.03,8.64 IC6.2 16.51,15.68 17.53,16.7 17.53,18.8 19.05,20.32 19.05,30.48 R24.1
N$22  (via drill 0.6)
  Top 0.305: IC8.18 86.36,60.96 v80.01,60.96
  Bottom 0.305: v80.01,60.96 R15.1
N$25
  Top 0.203: IC12.6 IC12.7 R10.2
N$28
  Top 0.254: IC5.P$2 55.56,77.79 92.55,77.79 92.55,61.59 90.33,59.37 90.33,54.45 R16.2
N$29
  Top 0.203: R11.2 IC12.9 R10.1
N$31
  Top 0.203: IC12.3 R8.2 92.71,90.17 92.71,86.36 91.44,85.09 C26.2
N$33
  Top 0.203: D2.A D1.A R18.2
N$34
  Top 0.203: D4.C R20.1 D3.C
N$35
  Top 0.203: IC12.5 R17.2
  Bottom 0.203: R17.2 95.34,90.17 94.38,89.2 85.39,89.2 C17.2
N$36
  Top 0.305: IC6.13 16.51,20.32 R26.2 R9.1
OG_2.0V
  Top 0.305: C39.1 8.89,50.8 IC11.8 IC11.9
  Bottom 0.254: IC5.P$1 46.99,70.01 47.94,69.06 47.94,57.94 46.83,56.83 36.51,56.83 33.34,53.66 24.61,53.66 24.45,53.82 13.18,53.82 IC11.9
R_HIGH_8.0V
  Top 0.305: C23.1 IC6.7 IC6.6
  Bottom 0.254: IC8.2 89.38,58.42 91.12,60.17 104.46,60.17 105.25,59.37 105.25,39.05 71.6,5.4 31.43,5.4 C23.1
R_LOW_3.0V  (via drill 0.61)
  Top 0.254: v34.61,10.32 29.21,15.72 IC6.8
  Top 0.305: 27.94,17.78 IC6.9 | 27.94,17.78 IC6.8 | C24.1 27.94,17.78
  Bottom 0.254: IC8.4 93.98,53.18 97.63,49.53 97.63,42.55 92.55,37.47 92.55,35.88 66.99,10.32 v34.61,10.32
RESET
  Top 0.406: IC8.3 R16.1
RESET_CTRL  (via drill 0.6)
  Top 0.203: IC8.1 83.82,58.42 82.09,60.15 79.38,60.15 79.2,60.33 79.2,61.59 80.82,63.2 80.82,74.12 78.11,76.83 v66.67,76.83
  Bottom 0.203: U$1.P$4 11.43,78.74 13.34,76.83 v66.67,76.83
TDAC0.5V  (via drill 0.6)
  Top 0.305: IC12.12 92.71,101.6 92.3,102.01 91.44,102.87 48.26,102.87 v46.99,101.6
  Bottom 0.305: v46.99,101.6 U$1.P$32
TDAC0.7V  (via drill 0.6)
  Top 0.254: v71.12,38.1 55.88,38.1 R4.1
  Bottom 0.254: U$1.P$33 42.94,99.06 52.35,89.65 70.13,89.65 70.13,63.09 71.12,62.1 v71.12,38.1
TEMP  (via drill 0.6)
  Top 0.254: v24.13,102.87 C14.+
  Top 0.305: U$2.2 18.38,105.45 C14.+
  Bottom 0.254: U$1.P$36 31.75,101.6 29.21,101.6 27.94,102.87 v24.13,102.87
V1
  Top 0.305: IC5.P$21 R13.2 68.58,53.34 IC5.P$17
V1_V2_CTRL  (via drill 0.6)
  Top 0.203: v86.36,101.6 65.84,81.08 18.85,81.08 v17.78,80.01 | v88.9,109.22 100.33,109.22 111.76,97.79 111.76,43.18 104.14,43.18 v104.14,44.45
  Top 0.305: IC10.10 IC10.11
  Bottom 0.203: U$1.P$7 17.78,83.82 v17.78,80.01 | v86.36,101.6 88.9,104.14 v88.9,109.22 | v104.14,44.45 IC10.11
V2
  Top 0.305: R12.2 IC5.P$24 77.47,60.96 77.47,52.7 70.48,45.72 IC5.P$14
V_2  (via drill 0.61)
  Top 0.254: v90.33,50.48 v81.6,59.21
  Bottom 0.254: R13.1 73.66,63.5 74.61,64.45 78.11,64.45 81.6,60.96 v81.6,59.21 | v90.33,50.48 95.89,50.48 96.2,50.16 96.2,46.67 IC10.13
V_HIGH_7.5  (via drill 0.61)
  Top 0.254: IC11.14 C40.1 | v75.25,33.34 v68.9,33.34
  Top 0.305: IC10.19 IC10.2
  Bottom 0.254: IC11.14 IC11.13 | C40.1 35.4,52.07 46.67,40.8 67.94,40.8 68.9,39.85 v68.9,33.34 | IC10.2 v75.25,33.34
V_LOW_-8.5V
  Top 0.305: C25.1 IC6.14 15.24,19.05 R26.1 | IC10.14 96.52,39.37 IC10.9
  Bottom 0.254: IC6.14 13.97,12.22 15.4,10.79 15.4,8.57 17.46,6.51 25.08,6.51 28.1,9.53 28.1,11.11 28.89,11.91 31.75,11.91 35.88,7.78 69.06,7.78 96.52,35.24 IC10.9
V_MID_-0.7V
  Top 0.254: IC10.4 82.07,35.08 68.42,35.08 66.83,36.67 58.42,36.67 R22.2
  Top 0.305: IC10.17 IC10.4
  Top 0.406: C36.1 IC2.14
  Bottom 0.305: IC2.14 53.34,33.02 54.61,34.29 R22.2
V_SUB
  Top 0.305: C4.1 52.07,21.59 64.77,21.59 66.04,20.32 IC2.6 IC2.7
  Bottom 0.305: IC5.P$19 69.85,55.88 69.85,20.32 IC2.7
VAMP  (via drill 0.5)
  Top 0.203: D4.A D2.C R19.2 v27.94,101.6
  Bottom 0.203: v27.94,101.6 27.94,100.33 U$1.P$38
VCCD
  Top 0.203: IC5.P$6 T1.2 R21.2
VCCDBUF
  Top 0.203: T1.3 R21.1 R25.1 48.26,80.01 C26.1
VLG_4.0V
  Top 0.305: C37.1 IC11.2 IC11.1
  Bottom 0.305: IC5.P$5 45.72,59.69 IC11.1
VRD_11.0V  (via drill 0.6)
  Top 0.305: C38.1 6.35,59.69 IC11.7 IC11.6 12.7,60.96 12.7,71.12 15.24,73.66 34.29,73.66 v39.37,68.58
  Bottom 0.305: v39.37,68.58 44.45,68.58 IC5.P$3
VSS_0.5V  (via drill 0.61)
  Top 0.254: 90.01,100.33 90.01,87.31 89.06,86.36 89.06,84.77 91.28,82.55 91.28,78.9 52.39,78.9 46.04,71.91 46.04,64.45 IC5.P$4 47.94,62.55 47.94,34.45 54.45,27.94 54.45,22.54 v64.61,22.54
  Top 0.305: IC12.13 90.01,100.33 IC12.14
  Bottom 0.254: C7.1 66.04,16.99 64.61,18.41 v64.61,22.54